# Altium schematic sheet electronic tape measure.SchDoc
size A0
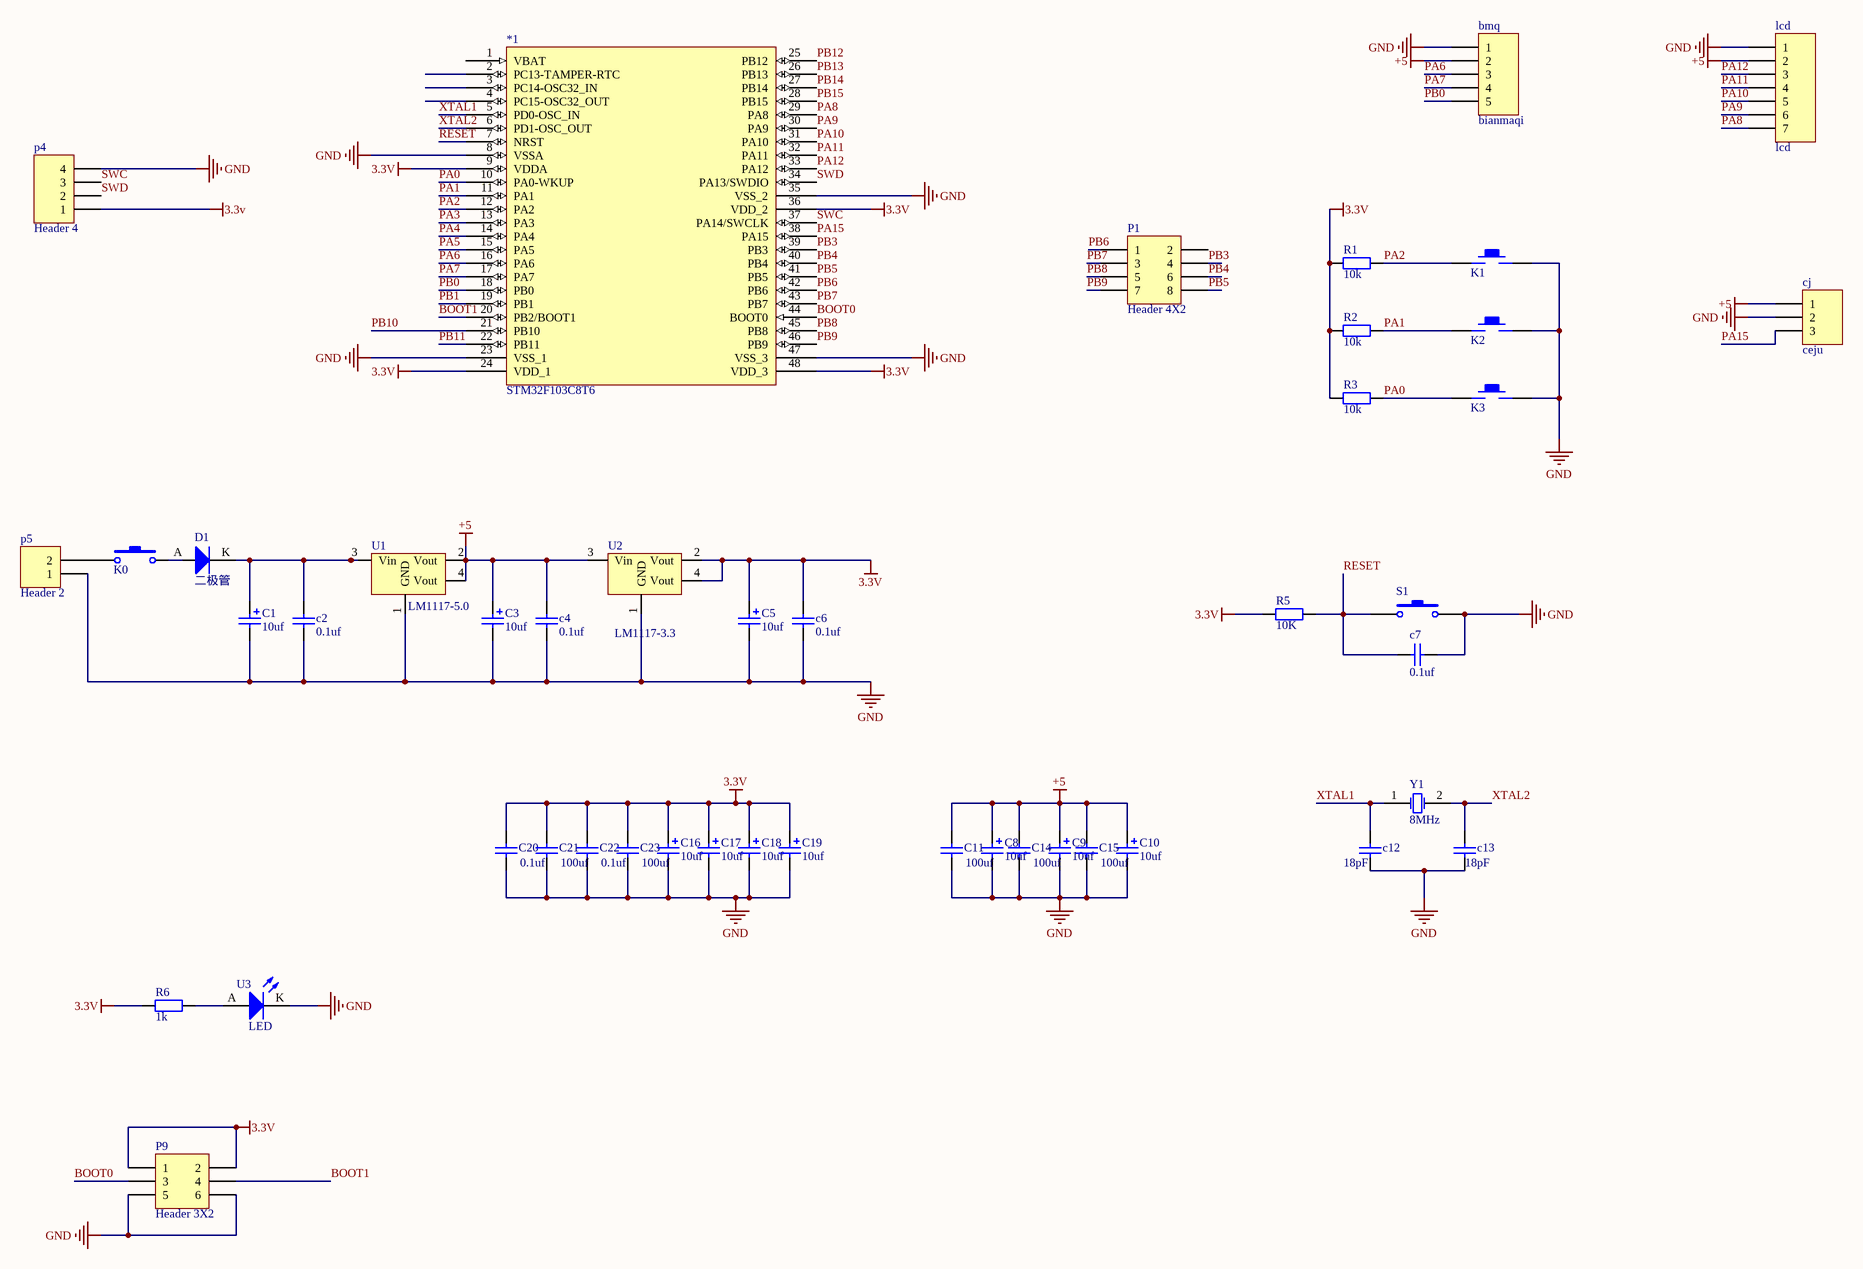
[diagram p0: electronic tape measure.SchDoc]

## Parts
*1  STM32F103C8T6  [STM32F103C8T6]
bmq  bianmaqi  [HDR1X5]
C1  10uf  [钽电容]
c2  0.1uf  [0805电容]
C3  10uf  [钽电容]
c4  0.1uf  [0805电容]
C5  10uf  [钽电容]
c6  0.1uf  [0805电容]
c7  0.1uf  [0805电容]
C8  10uf  [钽电容]
C9  10uf  [钽电容]
C10  10uf  [钽电容]
C11  100uf  [0805电容]
c12  value 18pF  [0805电容]
c13  value 18pF  [0805电容]
C14  100uf  [0805电容]
C15  100uf  [0805电容]
C16  10uf  [钽电容]
C17  10uf  [钽电容]
C18  10uf  [钽电容]
C19  10uf  [钽电容]
C20  0.1uf  [0805电容]
C21  100uf  [0805电容]
C22  0.1uf  [0805电容]
C23  100uf  [0805电容]
cj  ceju  [HDR1X3]
D1  二极管  [二极管]
K0  贴片按键  [开关]  (value not drawn)
K1  KEY_M  [KEY_M]  (value not drawn)
K2  KEY_M  [KEY_M]  (value not drawn)
K3  KEY_M  [KEY_M]  (value not drawn)
lcd  lcd  [HDR1X7]
P1  Header 4X2  [HDR2X4]
p4  Header 4  [HDR1X4]
p5  Header 2  [接线端子2P]
P9  Header 3X2  [HDR2X3]
R1  10k  [0805电阻]
R2  10k  [0805电阻]
R3  10k  [0805电阻]
R5  10K  [0805电阻]
R6  1k  [0805电阻]
S1  (no value)  [贴片按键]
U1  LM1117-5.0  [LM117]
U2  LM1117-3.3  [LM117]
U3  LED  [LED]
Y1  8MHz  [晶振]

## Nets
3.3V: *1.9(VDDA) *1.24(VDD_1) *1.36(VDD_2) *1.48(VDD_3) C5.A c6.2 C16.A C17.A C18.A C19.A C20.1 C21.1 C22.1 C23.1 p4.1 P9.1 P9.2 R1.1 R2.1 R3.1 R5.2 R6.1 U2.2(Vout) U2.4(Vout)
+5: bmq.2 C3.A c4.2 C8.A C9.A C10.A C11.1 C14.1 C15.1 cj.1 lcd.2 U1.2(Vout) U1.4(Vout) U2.3(Vin)
GND: *1.8(VSSA) *1.23(VSS_1) *1.35(VSS_2) *1.47(VSS_3) bmq.1 C1.K c2.1 C3.K c4.1 C5.K c6.1 c7.1 C8.K C9.K C10.K C11.2 c12.1 c13.1 C14.2 C15.2 C16.K C17.K C18.K C19.K C20.2 C21.2 C22.2 C23.2 cj.2 K1.2 K2.2 K3.2 lcd.1 p4.4 p5.1 P9.5 P9.6 S1.2 U1.1(GND) U2.1(GND) U3.K
BOOT0: *1.44(BOOT0) P9.3
BOOT1: *1.20(PB2/BOOT1) P9.4
PA0: *1.10(PA0-WKUP) K3.1 R3.2
PA1: *1.11(PA1) K2.1 R2.2
PA2: *1.12(PA2) K1.1 R1.2
PA3: *1.13(PA3)
PA4: *1.14(PA4)
PA5: *1.15(PA5)
PA6: *1.16(PA6) bmq.3
PA7: *1.17(PA7) bmq.4
PA8: *1.29(PA8) lcd.7
PA9: *1.30(PA9) lcd.6
PA10: *1.31(PA10) lcd.5
PA11: *1.32(PA11) lcd.4
PA12: *1.33(PA12) lcd.3
PA15: *1.38(PA15) cj.3
PB0: *1.18(PB0) bmq.5
PB1: *1.19(PB1)
PB3: *1.39(PB3) P1.4
PB4: *1.40(PB4) P1.6
PB5: *1.41(PB5) P1.8
PB6: *1.42(PB6) P1.1
PB7: *1.43(PB7) P1.3
PB8: *1.45(PB8) P1.5
PB9: *1.46(PB9) P1.7
PB10: *1.21(PB10)
PB11: *1.22(PB11)
PB12: *1.25(PB12)
PB13: *1.26(PB13)
PB14: *1.27(PB14)
PB15: *1.28(PB15)
RESET: *1.7(NRST) c7.2 R5.1 S1.1
SWC: *1.37(PA14/SWCLK) p4.3
SWD: *1.34(PA13/SWDIO) p4.2
XTAL1: *1.5(PD0-OSC_IN) c12.2 Y1.1(OSC1)
XTAL2: *1.6(PD1-OSC_OUT) c13.2 Y1.2(OSC2)
NetC1_A: C1.A c2.2 D1.K U1.3(Vin)
NetD1_A: D1.A K0.2
NetK0_1: K0.1 p5.2
NetR6_2: R6.2 U3.A

Not connected (* = marked no-connect by the designer): *1 1(VBAT) 2(PC13-TAMPER-RTC) 3(PC14-OSC32_IN) 4(PC15-OSC32_OUT); P1 2

## Library data of the parts
bmq = Header 5: Header, 5-Pin; LatestRevisionDate: 17-Jul-2002; LatestRevisionNote: Re-released for DXP Platform.; Publisher: Altium Limited
C1 C3 C5 C8-C10 C16-C19 = 极性电容
c2 c4 c6 c7 C11 C14 C15 C20-C23 = 电容
c12 c13 = Cap Semi: Capacitor (Semiconductor SIM Model); Published: 8-Jun-2000; LatestRevisionDate: 29-May-2009; LatestRevisionNote: IPC-7351 Footprint Added.; PackageReference: C1206; Publisher: Altium Limited; PackageDescription: Chip Capacitor
cj = Header 3: Header, 3-Pin; LatestRevisionDate: 17-Jul-2002; LatestRevisionNote: Re-released for DXP Platform.; Publisher: Altium Limited
lcd = Header 7: Header, 7-Pin; LatestRevisionDate: 17-Jul-2002; LatestRevisionNote: Re-released for DXP Platform.; Publisher: Altium Limited
P1 = Header 4X2: Header, 4-Pin, Dual row; LatestRevisionDate: 17-Jul-2002; LatestRevisionNote: Re-released for DXP Platform.; Publisher: Altium Limited
p4 = Header 4: Header, 4-Pin; LatestRevisionDate: 17-Jul-2002; LatestRevisionNote: Re-released for DXP Platform.; Publisher: Altium Limited
p5 = Header 2: Header, 2-Pin; LatestRevisionDate: 17-Jul-2002; LatestRevisionNote: Re-released for DXP Platform.; Publisher: Altium Limited
P9 = Header 3X2: Header, 3-Pin, Dual row; LatestRevisionDate: 17-Jul-2002; LatestRevisionNote: Re-released for DXP Platform.; Publisher: Altium Limited
R1-R3 R6 = 电阻
R5 = Res2: Resistor; Published: 8-Jun-2000; LatestRevisionDate: 17-Jul-2002; LatestRevisionNote: Re-released for DXP Platform.; PackageReference: AXIAL-0.4; Publisher: Altium Limited; PackageDescription: Axial Device, Thru-Hole; 2 Leads; 0.4 in Pin Spacing; Value: 10K
S1 = SW-PB: Switch; Published: 24-Mar-1999; LatestRevisionDate: 17-Jul-2002; LatestRevisionNote: Re-released for DXP Platform.; PackageReference: SPST-2; Publisher: Altium Limited; PackageDescription: Switch; 2 Leads
U1 U2 = LM117
Y1 = XTAL: Crystal Oscillator; Published: 8-Jun-2000; LatestRevisionDate: 17-Jul-2002; LatestRevisionNote: Re-released for DXP Platform.; PackageReference: R38; Publisher: Altium Limited; PackageDescription: Crystal, Thru-Hole; 2 Leads; Body 3.1 x 8.2 mm (Dia.xH)